# Altium project Industrial Instrumentation Controller.PrjPcb
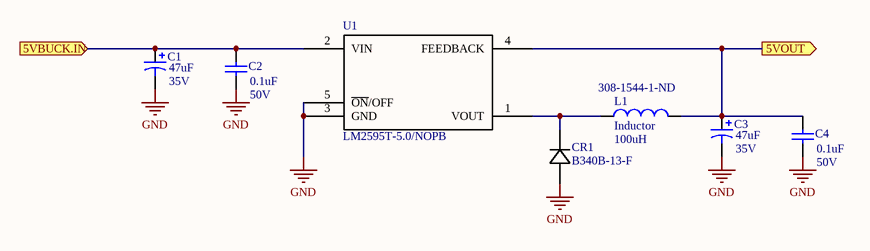
[diagram p0: 5VBuckConverterSM.SchDoc]
2 sheets, 36 parts. Net scope: hierarchical (ports join the sheet entries above them; power ports are global).
Board files: PCBSM.PcbDoc, 0PCBSM.PcbDoc
Sheets:
  5VBuckConverterSM.SchDoc
  Input Subsystem.SchDoc

## Sheet 5VBuckConverterSM.SchDoc
size A; SheetNumber: 3; SheetTotal: 7; SPICEModelCacheJBXWNVDI: <root> / <DocumentId>JBXWNVDI</DocumentId> / </root>

### Parts
C1  value 47uF  Voltage Rating: 35V  [RB7.6-15]  (hidden comment: Cap Pol1)
C2  value 0.1uF  Voltage Rating: 50V  [RAD-0.3]  (hidden comment: Cap)
C3  value 47uF  Voltage Rating: 35V  [RB7.6-15]  (hidden comment: Cap Pol1)
C4  value 0.1uF  Voltage Rating: 50V  [RAD-0.3]  (hidden comment: Cap)
CR1  B340B-13-F  [B340A-13-F]
L1  Inductor  value 100uH  Supplier Part Number 1: 308-1544-1-ND  [0402-A]
U1  LM2595T-5.0/NOPB  [LM2595ST-5P0]

### Ports
5VBUCK.IN (in), 5VOUT (out)

### Nets
GND: C1.2 C2.1 C3.2 C4.1 CR1.2 U1.3(GND) U1.5(~{ON}/OFF)
NetC1_1: C1.1 C2.2 U1.2(VIN) ; port 5VBUCK.IN
NetC3_1: C3.1 C4.2 L1.2 U1.4(FEEDBACK) ; port 5VOUT
NetCR1_1: CR1.1 L1.1 U1.1(VOUT)

### Library data of the parts
C1 C3 = Cap Pol1: Polarized Capacitor (Radial); Published: 8-Jun-2000; LatestRevisionDate: 17-Jul-2002; LatestRevisionNote: Re-released for DXP Platform.; PackageReference: RB7.6-15; Publisher: Altium Limited; PackageDescription: Polarized Capacitor (Radial); 2 Leads
C2 C4 = Cap: Capacitor; Published: 8-Jun-2000; LatestRevisionDate: 17-Jul-2002; LatestRevisionNote: Re-released for DXP Platform.; PackageReference: RAD-0.3; Publisher: Altium Limited; PackageDescription: Radial Cap, Thru-Hole; 2 Leads; 0.3 in Pin Spacing
CR1 = B340B-13-F: No Description Available; Mfr_Name: Diodes Inc; Type: DEV; Copyright: Copyright (C) 2022 Ultra Librarian. All rights reserved.; Manufacturer_Part_Number: B340B-13-F; Digi-Key_Part_Number_1: B340B-FDITR-ND; Digi-Key_Part_Number_2: B340B-FDIDKR-ND; Digi-Key_Part_Number_3: B340B-FDICT-ND; RefDes: RefDes
L1 = Inductor: Ind Power Shielded Wirewound 100uH 20% 100KHz 1.6A Carrier T/R; Manufacturer: Sumida; Manufacturer Part Number: CDRH125/LDNP-101MC; Code_IEC: 1005; Core Material: Ferrite; DC Resistance (DCR): 187mR; Published: 8-Jun-2000; LatestRevisionDate: 29-May-2009; LatestRevisionNote: IPC-7351 Footprint Added.; PackageReference: 0402-A; Publisher: Altium Limited; PackageDescription: Chip Inductor; Code_JEITA: 0402; Supplier 1: Digi-Key; RoHS: Yes; Category: Fixed Inductors; Stock 1: 1012; Pricing 1: 1=1.46000, 10=1.35800, 25=1.25360, 50=1.04480, 100=0.98210, 250=0.87760 (USD); Mount: Surface Mount; Case/Package: Nonstandard; Min Operating Temperature: -40°C; Max Operating Temperature: 100°C; Current Rating: 1.6A; Packaging: Tape and Reel; Tolerance: 20%; Package Quantity: 1; Shielding: Shielded; Inductance: 100uH; Test Frequency: 100kHz; Max DC Current: 1.6A; Termination: SMD/SMT; Series: CDRH125/LD; Rated Current-Max: 1.6A; Length: 0.472inch; Width: 0.472inch; Height: 6mm; Height - Seated (Max): 0.236inch; Depth: 12.3mm; Radiation Hardening: No; Lead Free: Lead Free; RoHS Compliant: Yes; ComponentLink1URL: http://www.mouser.com/ds/2/390/CDRH125LD-523473.pdf?src-supplier=Mouser; ComponentLink1Description: http://www.mouser.com/ds/2/390/CDRH125LD-523473.pdf?src-supplier=Mouser; ComponentLink2URL: http://products.sumida.com/products/pdf/CDRH125,CDRH125LD.pdf?src-supplier=Digi-Key; ComponentLink2Description: http://products.sumida.com/products/pdf/CDRH125,CDRH125LD.pdf?src-supplier=Digi-Key; ComponentLink3URL: http://www.sumida.com/products/pdf/CDRH125,CDRH125LD.pdf?src-supplier=Avnet; ComponentLink3Description: http://www.sumida.com/products/pdf/CDRH125,CDRH125LD.pdf?src-supplier=Avnet; ComponentLink4URL: http://www.sumida.com/products/pdf/CDRH125,CDRH125LD.pdf?src-supplier=Future+Electronics; ComponentLink4Description: http://www.sumida.com/products/pdf/CDRH125,CDRH125LD.pdf?src-supplier=Future+Electronics

## Sheet Input Subsystem.SchDoc
size A; SheetNumber: 6; SheetTotal: 7
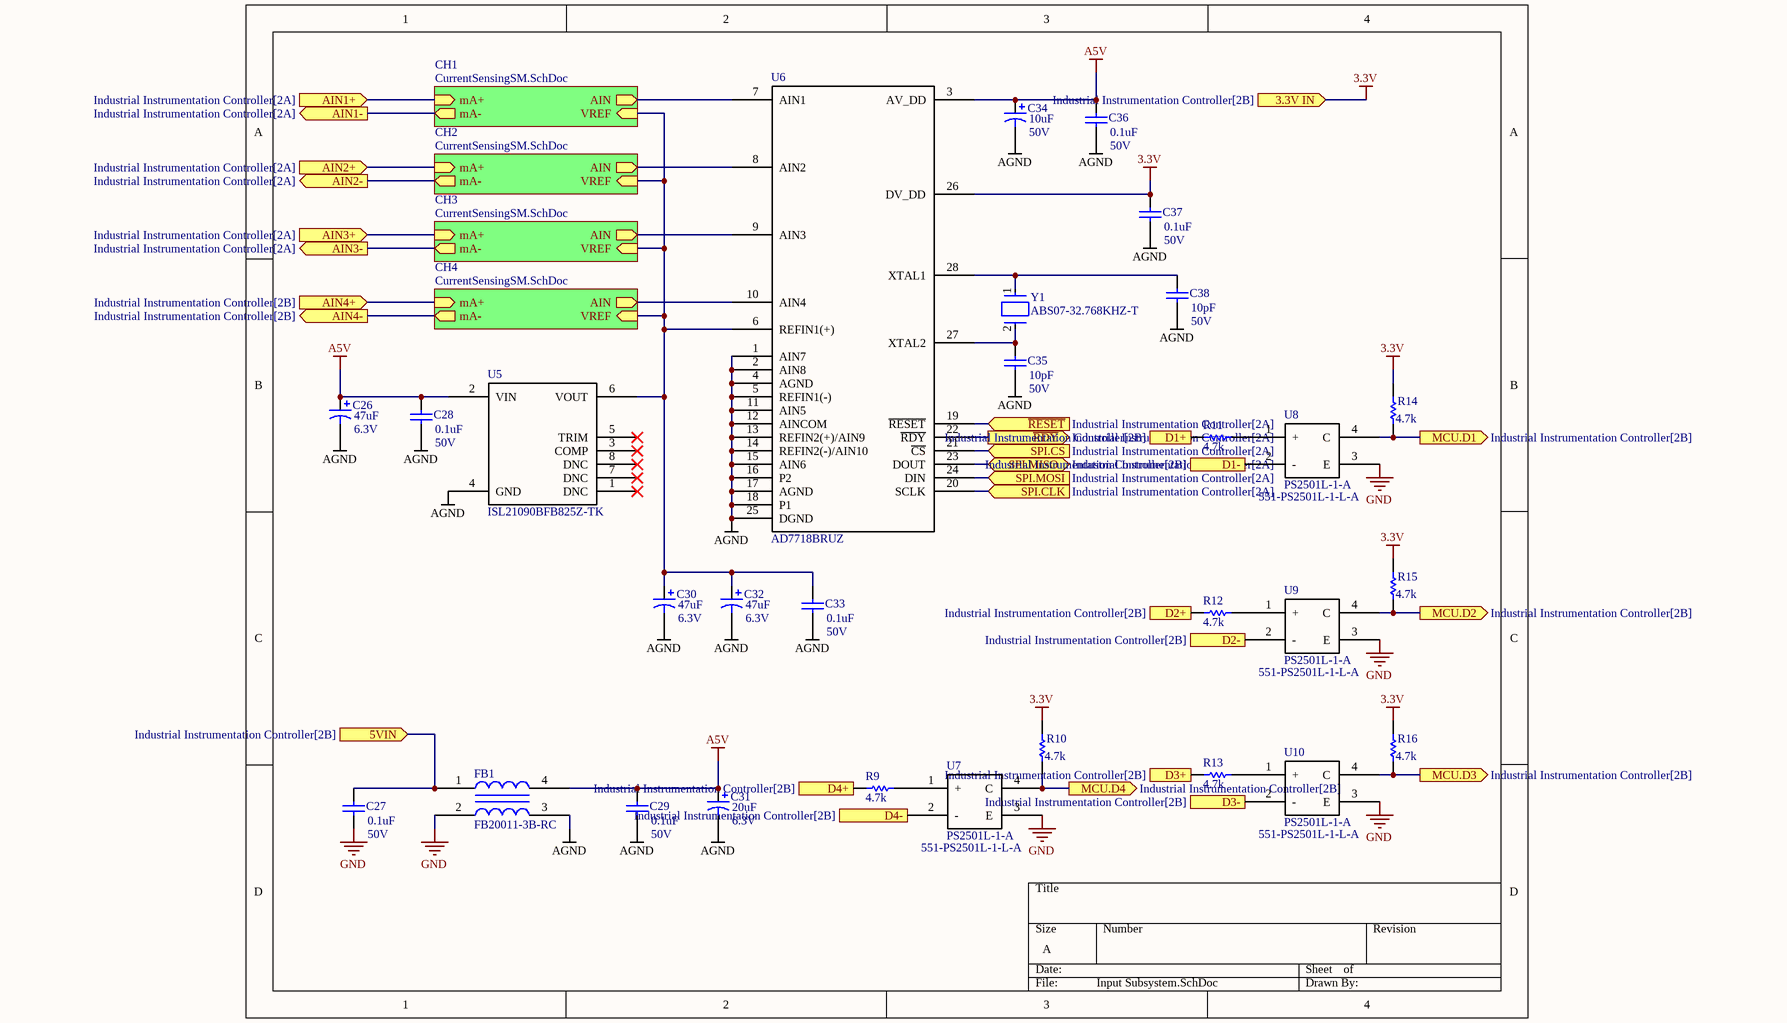
[diagram p1: Input Subsystem.SchDoc]

### Parts
C26  value 47uF  Voltage Rating: 6.3V  [RB7.6-15]  (hidden comment: Cap Pol1)
C27  value 0.1uF  Voltage Rating: 50V  [RAD-0.3]  (hidden comment: Cap)
C28  value 0.1uF  Voltage Rating: 50V  [RAD-0.3]  (hidden comment: Cap)
C29  value 0.1uF  Voltage Rating: 50V  [RAD-0.3]  (hidden comment: Cap)
C30  value 47uF  Voltage Rating: 6.3V  [RB7.6-15]  (hidden comment: Cap Pol1)
C31  value 20uF  Voltage Rating: 6.3V  [RB7.6-15]  (hidden comment: Cap Pol1)
C32  value 47uF  Voltage Rating: 6.3V  [RB7.6-15]  (hidden comment: Cap Pol1)
C33  value 0.1uF  Voltage Rating: 50V  [RAD-0.3]  (hidden comment: Cap)
C34  value 10uF  Voltage Rating: 50V  [RB7.6-15]  (hidden comment: Cap Pol1)
C35  value 10pF  Voltage Rating: 50V  [RAD-0.3]  (hidden comment: Cap)
C36  value 0.1uF  Voltage Rating: 50V  [RAD-0.3]  (hidden comment: Cap)
C37  value 0.1uF  Voltage Rating: 50V  [RAD-0.3]  (hidden comment: Cap)
C38  value 10pF  Voltage Rating: 50V  [RAD-0.3]  (hidden comment: Cap)
FB1  FB20011-3B-RC  [FB20011]
R9  value 4.7k  [AXIAL-0.3]  (hidden comment: Res1)
R10  value 4.7k  [AXIAL-0.3]  (hidden comment: Res1)
R11  value 4.7k  [AXIAL-0.3]  (hidden comment: Res1)
R12  value 4.7k  [AXIAL-0.3]  (hidden comment: Res1)
R13  value 4.7k  [AXIAL-0.3]  (hidden comment: Res1)
R14  value 4.7k  [AXIAL-0.3]  (hidden comment: Res1)
R15  value 4.7k  [AXIAL-0.3]  (hidden comment: Res1)
R16  value 4.7k  [AXIAL-0.3]  (hidden comment: Res1)
U5  ISL21090BFB825Z-TK  [ISL21090BFB825Z-TK]
U6  AD7718BRUZ  [AD7718BRUZ]
U7  PS2501L-1-A  Supplier Part Number 1: 551-PS2501L-1-L-A  [PS2501L-1-A]
U8  PS2501L-1-A  Supplier Part Number 1: 551-PS2501L-1-L-A  [PS2501L-1-A]
U9  PS2501L-1-A  Supplier Part Number 1: 551-PS2501L-1-L-A  [PS2501L-1-A]
U10  PS2501L-1-A  Supplier Part Number 1: 551-PS2501L-1-L-A  [PS2501L-1-A]
Y1  ABS07-32.768KHZ-T  [FP-ABS07-MFG]

### Sub-sheets
CH1 = CurrentSensingSM.SchDoc (file not in this document): mA+ (in), mA- (out), AIN (out), VREF (in)
CH2 = CurrentSensingSM.SchDoc (file not in this document): mA+ (in), mA- (out), AIN (out), VREF (in)
CH3 = CurrentSensingSM.SchDoc (file not in this document): mA+ (in), mA- (out), AIN (out), VREF (in)
CH4 = CurrentSensingSM.SchDoc (file not in this document): mA+ (in), mA- (out), AIN (out), VREF (in)

### Ports
3.3V IN (in, see Industrial Instrumentation Controller[2B]), 5VIN (in, see Industrial Instrumentation Controller[2B]), AIN1+ (in, see Industrial Instrumentation Controller[2A]), AIN1- (out, see Industrial Instrumentation Controller[2A]), AIN2+ (in, see Industrial Instrumentation Controller[2A]), AIN2- (out, see Industrial Instrumentation Controller[2A]), AIN3+ (in, see Industrial Instrumentation Controller[2A]), AIN3- (out, see Industrial Instrumentation Controller[2A]), AIN4+ (in, see Industrial Instrumentation Controller[2B]), AIN4- (out, see Industrial Instrumentation Controller[2B]), D1+ (in, see Industrial Instrumentation Controller[2B]), D1- (out, see Industrial Instrumentation Controller[2B]), D2+ (in, see Industrial Instrumentation Controller[2B]), D2- (out, see Industrial Instrumentation Controller[2B]), D3+ (in, see Industrial Instrumentation Controller[2B]), D3- (out, see Industrial Instrumentation Controller[2B]), D4+ (in, see Industrial Instrumentation Controller[2B]), D4- (out, see Industrial Instrumentation Controller[2B]), MCU.D1 (out, see Industrial Instrumentation Controller[2B]), MCU.D2 (out, see Industrial Instrumentation Controller[2B]), MCU.D3 (out, see Industrial Instrumentation Controller[2B]), MCU.D4 (out, see Industrial Instrumentation Controller[2B]), SPI.CLK (in, see Industrial Instrumentation Controller[2A]), SPI.CS (in, see Industrial Instrumentation Controller[2A]), SPI.MISO (bidir, see Industrial Instrumentation Controller[2A]), SPI.MOSI (in, see Industrial Instrumentation Controller[2A]), ~{RDY} (out, see Industrial Instrumentation Controller[2A]), ~{RESET} (in, see Industrial Instrumentation Controller[2A])

### Nets
3.3V: C37.2 R10.2 R14.2 R15.2 R16.2 U6.26(DV_DD) ; port 3.3V IN
A5V: C26.1 C28.2 C29.2 C31.1 C34.1 C36.2 FB1.4(A5V) U5.2(VIN) U6.3(AV_DD)
AGND: C26.2 C28.1 C29.1 C30.2 C31.2 C32.2 C33.1 C34.2 C35.1 C36.1 C37.1 C38.1 FB1.3(AGND) U5.4(GND) U6.1(AIN7) U6.2(AIN8) U6.4(AGND) U6.5(REFIN1(-)) U6.11(AIN5) U6.12(AINCOM) U6.13(REFIN2(+)/AIN9) U6.14(REFIN2(-)/AIN10) U6.15(AIN6) U6.16(P2) U6.17(AGND) U6.18(P1) U6.25(DGND)
GND: C27.1 FB1.2(GND) U7.3(E) U8.3(E) U9.3(E) U10.3(E)
NetC27_2: C27.2 FB1.1(5V) ; port 5VIN
NetC30_1: C30.1 C32.1 C33.2 U5.6(VOUT) U6.6(REFIN1(+)) ; sheet CH1/VREF, sheet CH2/VREF, sheet CH3/VREF, sheet CH4/VREF
NetC35_2: C35.2 U6.27(XTAL2) Y1.2
NetC38_2: C38.2 U6.28(XTAL1) Y1.1
NetR9_1: R9.1 U7.1(+)
NetR9_2: R9.2 ; port D4+
NetR10_1: R10.1 U7.4(C) ; port MCU.D4
NetR11_1: R11.1 U8.1(+)
NetR11_2: R11.2 ; port D1+
NetR12_1: R12.1 U9.1(+)
NetR12_2: R12.2 ; port D2+
NetR13_1: R13.1 U10.1(+)
NetR13_2: R13.2 ; port D3+
NetR14_1: R14.1 U8.4(C) ; port MCU.D1
NetR15_1: R15.1 U9.4(C) ; port MCU.D2
NetR16_1: R16.1 U10.4(C) ; port MCU.D3
NetU6_7: U6.7(AIN1) ; sheet CH1/AIN
NetU6_8: U6.8(AIN2) ; sheet CH2/AIN
NetU6_9: U6.9(AIN3) ; sheet CH3/AIN
NetU6_10: U6.10(AIN4) ; sheet CH4/AIN
NetU6_19: U6.19(~{RESET}) ; port ~{RESET}
NetU6_20: U6.20(SCLK) ; port SPI.CLK
NetU6_21: U6.21(~{CS}) ; port SPI.CS
NetU6_22: U6.22(~{RDY}) ; port ~{RDY}
NetU6_23: U6.23(DOUT) ; port SPI.MISO
NetU6_24: U6.24(DIN) ; port SPI.MOSI
NetU7_2: U7.2(-) ; port D4-
NetU8_2: U8.2(-) ; port D1-
NetU9_2: U9.2(-) ; port D2-
NetU10_2: U10.2(-) ; port D3-
(unnamed): port AIN1+, sheet CH1/mA+
(unnamed): port AIN1-, sheet CH1/mA-
(unnamed): port AIN2+, sheet CH2/mA+
(unnamed): port AIN2-, sheet CH2/mA-
(unnamed): port AIN3+, sheet CH3/mA+
(unnamed): port AIN3-, sheet CH3/mA-
(unnamed): port AIN4+, sheet CH4/mA+
(unnamed): port AIN4-, sheet CH4/mA-

Not connected (* = marked no-connect by the designer): U5 1(DNC)* 3(COMP)* 5(TRIM)* 7(DNC)* 8(DNC)*

### Library data of the parts
C26 C30-C32 C34 = Cap Pol1: Polarized Capacitor (Radial); Published: 8-Jun-2000; LatestRevisionDate: 17-Jul-2002; LatestRevisionNote: Re-released for DXP Platform.; PackageReference: RB7.6-15; Publisher: Altium Limited; PackageDescription: Polarized Capacitor (Radial); 2 Leads
C27-C29 C33 C35-C38 = Cap: Capacitor; Published: 8-Jun-2000; LatestRevisionDate: 17-Jul-2002; LatestRevisionNote: Re-released for DXP Platform.; PackageReference: RAD-0.3; Publisher: Altium Limited; PackageDescription: Radial Cap, Thru-Hole; 2 Leads; 0.3 in Pin Spacing
FB1 = FB20011
R9-R16 = Res1: Resistor; Published: 8-Jun-2000; LatestRevisionDate: 17-Jul-2002; LatestRevisionNote: Re-released for DXP Platform.; PackageReference: AXIAL-0.3; Publisher: Altium Limited; PackageDescription: Axial Device, Thru-Hole; 2 Leads; 0.3 in Pin Spacing
U7-U10 = PS2501L-1-A: Optocoupler DC-IN 1-CH Transistor DC-OUT 4-Pin PDIP SMD Magazine; Manufacturer: CEL; Manufacturer Part Number: PS2501L-1-L-A; Collector Emitter Voltage (VCEO): 300mV; Input Type: DC; Current Transfer Ratio: 300%; Number of Channels: 1; Max Power Dissipation: 150mW; Forward Current: 10mA; Max Collector Current: 50mA; Isolation Voltage: 5kV; Output Voltage: 80V; Supplier 1: Mouser; RoHS: Yes; Category: Optocouplers; Mount: Surface Mount; Case/Package: SMD/SMT; Min Operating Temperature: -55°C; Max Operating Temperature: 100°C; Packaging: Rail/Tube; Collector Emitter Saturation Voltage: 300mV; Package Quantity: 100; Output Current per Channel: 50mA; Series: NEPOC; Collector-emitter Voltage-Max: 300mV; Lead Free: Lead Free; ComponentLink1URL: https://datasheet.ciiva.com/2088/ps2501-2088124.pdf?src-supplier=Digi-Key; ComponentLink1Description: https://datasheet.ciiva.com/2088/ps2501-2088124.pdf?src-supplier=Digi-Key
Y1 = CMP-0447-00001-4: Crystal 32.768kHz ±20ppm (Tol) 12.5pF FUND 70kΩ 2-Pin CSMD T/R; ESR (Equivalent Series Resistance): 70kR; Radiation Hardening: No; Frequency: 32.768kHz; Length: 3.2mm; Max Operating Temperature: 85°C; Number of Pins: 2; Series: ABS07; Min Operating Temperature: -40°C; Frequency Tolerance: 20ppm; Packaging: Tape and Reel; Height: 0.9mm; Width: 1.5mm; Depth: 1.5mm; Load Capacitance: 12.5pF; RoHS Compliant: Yes; Tolerance: 20ppm; Termination: SMD/SMT; Lead Free: Lead Free; Series Resistance: 70kR; REACH SVHC: No SVHC; Case/Package: CSMD; Operating Frequency: 32.768 kHz; Package Quantity: 3000

## Nets that join several sheets
GND: 5VBuckConverterSM (7 pins), Input Subsystem (6 pins)